# Altium schematic sheet Perifericos.SchDoc
size A4
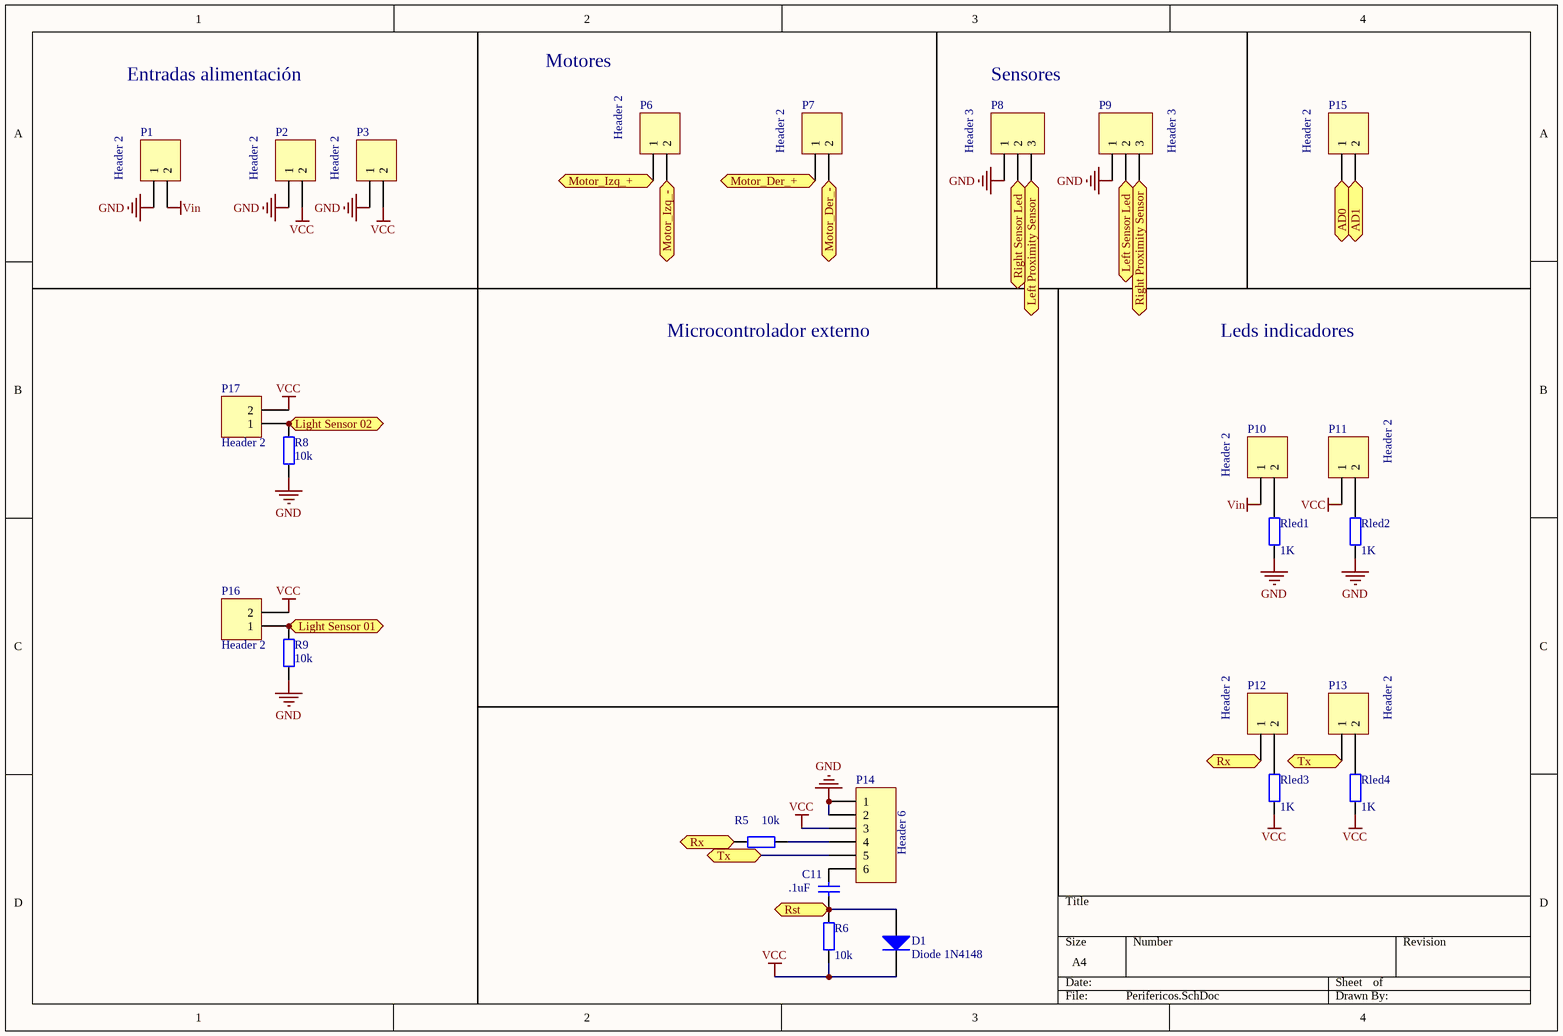
[diagram p0: Perifericos.SchDoc]

## Parts
C11  value .1uF  [RAD-0.3]  (hidden comment: Cap)
D1  Diode 1N4148  [DO-35]
P1  Header 2  [HDR1X2]
P2  Header 2  [HDR1X2]
P3  Header 2  [HDR1X2]
P6  Header 2  [HDR1X2]
P7  Header 2  [HDR1X2]
P8  Header 3  [HDR1X3]
P9  Header 3  [HDR1X3]
P10  Header 2  [HDR1X2]
P11  Header 2  [HDR1X2]
P12  Header 2  [HDR1X2]
P13  Header 2  [HDR1X2]
P14  Header 6  [HDR1X6]
P15  Header 2  [HDR1X2]
P16  Header 2  [HDR1X2]
P17  Header 2  [HDR1X2]
R5  value 10k  [AXIAL-0.4]  (hidden comment: Res2)
R6  value 10k  [AXIAL-0.4]  (hidden comment: Res2)
R8  value 10k  [AXIAL-0.4]  (hidden comment: Res2)
R9  value 10k  [AXIAL-0.4]  (hidden comment: Res2)
Rled1  value 1K  [AXIAL-0.4]  (hidden comment: Res2)
Rled2  value 1K  [AXIAL-0.4]  (hidden comment: Res2)
Rled3  value 1K  [AXIAL-0.4]  (hidden comment: Res2)
Rled4  value 1K  [AXIAL-0.4]  (hidden comment: Res2)

## Ports
AD0, AD1, Left Proximity Sensor, Left Sensor Led, Light Sensor 01, Light Sensor 02, Motor_Der_+, Motor_Der_-, Motor_Izq_+, Motor_Izq_-, Right Proximity Sensor, Right Sensor Led, Rst, Rx, Tx

## Nets
GND: P1.1 P2.1 P3.1 P8.1 P9.1 P14.1 P14.2 R8.1 R9.1 Rled1.1 Rled2.1
VCC: D1.2(K) P2.2 P3.2 P11.1 P14.3 P16.2 P17.2 R6.1 Rled3.1 Rled4.1
Vin: P1.2 P10.1
AD0: P15.1 ; port AD0
AD1: P15.2 ; port AD1
Left Proximity Sensor: P8.3 ; port Left Proximity Sensor
Left Sensor Led: P9.2 ; port Left Sensor Led
Light Sensor 01: P16.1 R9.2 ; port Light Sensor 01
Light Sensor 02: P17.1 R8.2 ; port Light Sensor 02
Motor_Der_+: P7.1 ; port Motor_Der_+
Motor_Der_-: P7.2 ; port Motor_Der_-
Motor_Izq_+: P6.1 ; port Motor_Izq_+
Motor_Izq_-: P6.2 ; port Motor_Izq_-
Right Proximity Sensor: P9.3 ; port Right Proximity Sensor
Right Sensor Led: P8.2 ; port Right Sensor Led
Rst: C11.1 D1.1(A) R6.2 ; port Rst
Rx: P12.1 R5.1 ; port Rx
Tx: P13.1 P14.5 ; port Tx
NetC11_2: C11.2 P14.6
NetP10_2: P10.2 Rled1.2
NetP11_2: P11.2 Rled2.2
NetP12_2: P12.2 Rled3.2
NetP13_2: P13.2 Rled4.2
NetP14_4: P14.4 R5.2

## Notes on the sheet
- Entradas alimentación
- Motores
- Sensores
- Microcontrolador externo
- Leds indicadores

## Library data of the parts
C11 = Cap: Capacitor; Published: 8-Jun-2000; LatestRevisionDate: 17-Jul-2002; LatestRevisionNote: Re-released for DXP Platform.; PackageReference: RAD-0.3; Publisher: Altium Limited; PackageDescription: Radial Cap, Thru-Hole; 2 Leads; 0.3 in Pin Spacing
D1 = Diode 1N4148: High Conductance Fast Diode; Published: 8-Jun-2000; LatestRevisionDate: 17-Jul-2002; LatestRevisionNote: Re-released for DXP Platform.; DatasheetVersion: 1997; PackageReference: DO-35; Publisher: Altium Limited; PackageDescription: Diode, Axial; Body 3.8 x 1.9 mm (LxDia. max), Lead Dia. 0.53 mm (max); Code_JEDEC: DO-204-AH; ComponentLink1Description: Manufacturer Link; ComponentLink1URL: http://www.fairchildsemi.com/; ComponentLink2Description: Datasheet; ComponentLink2URL: http://www.fairchildsemi.com/ds/1N%2F1N4148.pdf
P1-P3 P6 P7 P10-P13 P15-P17 = Header 2: Header, 2-Pin; LatestRevisionDate: 17-Jul-2002; LatestRevisionNote: Re-released for DXP Platform.; Publisher: Altium Limited
P8 P9 = Header 3: Header, 3-Pin; LatestRevisionDate: 17-Jul-2002; LatestRevisionNote: Re-released for DXP Platform.; Publisher: Altium Limited
P14 = Header 6: Header, 6-Pin; LatestRevisionDate: 17-Jul-2002; LatestRevisionNote: Re-released for DXP Platform.; Publisher: Altium Limited
R5 R6 R8 R9 Rled1-Rled4 = Res2: Resistor; Published: 8-Jun-2000; LatestRevisionDate: 17-Jul-2002; LatestRevisionNote: Re-released for DXP Platform.; PackageReference: AXIAL-0.4; Publisher: Altium Limited; PackageDescription: Axial Device, Thru-Hole; 2 Leads; 0.4 in Pin Spacing